# Altium schematic sheet Sheet1.SchDoc
size A4
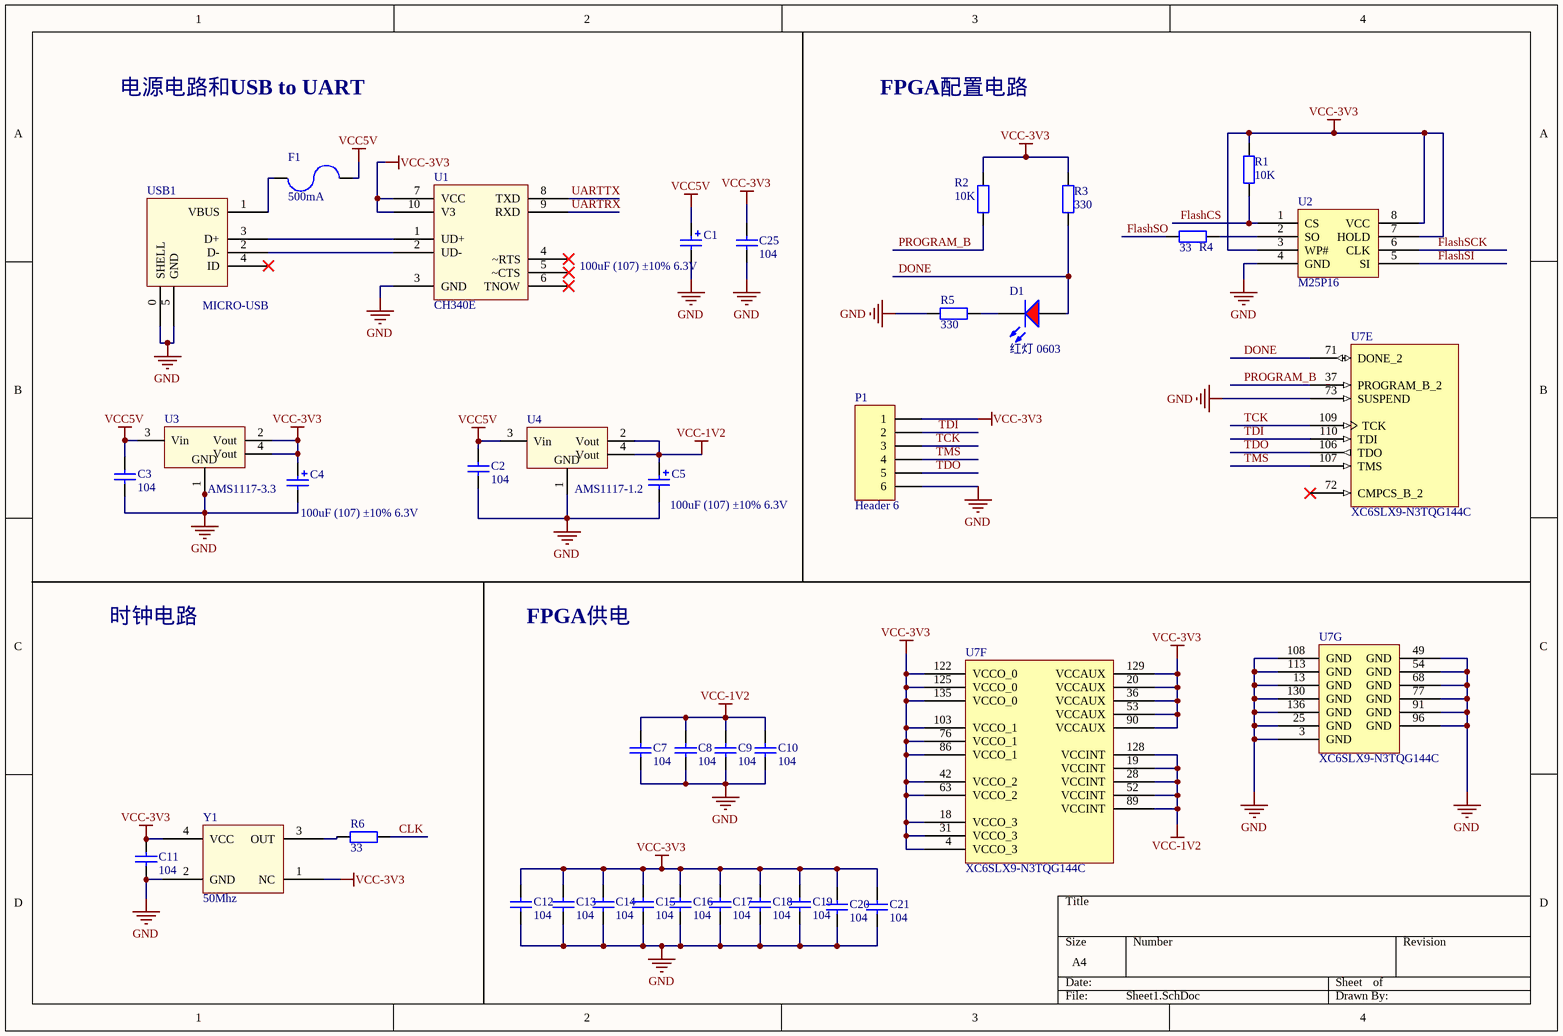
[diagram p0: Sheet1.SchDoc]

## Parts
C1  100uF (107) ±10% 6.3V  [CASE-B_3528]
C2  104  [0603_C]
C3  104  [0603_C]
C4  100uF (107) ±10% 6.3V  [CASE-B_3528]
C5  100uF (107) ±10% 6.3V  [CASE-B_3528]
C7  104  [0603_C]
C8  104  [0603_C]
C9  104  [0603_C]
C10  104  [0603_C]
C11  104  [0603_C]
C12  104  [0603_C]
C13  104  [0603_C]
C14  104  [0603_C]
C15  104  [0603_C]
C16  104  [0603_C]
C17  104  [0603_C]
C18  104  [0603_C]
C19  104  [0603_C]
C20  104  [0603_C]
C21  104  [0603_C]
C25  104  [0603_C]
D1  红灯 0603  [0603_LED_S1]
F1  500mA  [PTC[0805]]
P1  Header 6  [HDR1X6]
R1  10K  [0603_R]
R2  10K  [0603_R]
R3  330  [0603_R]
R4  33  [0603_R]
R5  330  [0603_R]
R6  33  [0603_R]
U1  CH340E  [MSOP10]
U2  M25P16  [SO-8]
U3  AMS1117-3.3  [SOT-223(AMS1117-3.3)]
U4  AMS1117-1.2  [SOT-223(AMS1117-3.3)]
U7  XC6SLX9-N3TQG144C  [TQG144_N]  (parts E,F,G of 7)
USB1  MICRO-USB  [MICRO-USB]
Y1  50Mhz  [XTAL5032]

## Nets
GND: C1.2 C2.1 C3.1 C4.2 C5.2 C7.1 C8.1 C9.1 C10.1 C11.1 C12.1 C13.1 C14.1 C15.1 C16.1 C17.1 C18.1 C19.1 C20.1 C21.1 C25.1 P1.6 R5.2 U1.3(GND) U2.4(GND) U3.1(GND) U4.1(GND) U7.3(GND) U7.13(GND) U7.25(GND) U7.49(GND) U7.54(GND) U7.68(GND) U7.73(SUSPEND) U7.77(GND) U7.91(GND) U7.96(GND) U7.108(GND) U7.113(GND) U7.130(GND) U7.136(GND) USB1.0(SHELL) USB1.5(GND) Y1.2(GND)
VCC5V: C1.1 C2.2 C3.2 F1.1 U3.3(Vin) U4.3(Vin)
VCC-1V2: C5.1 C7.2 C8.2 C9.2 C10.2 U4.2(Vout) U4.4(Vout) U7.19(VCCINT) U7.28(VCCINT) U7.52(VCCINT) U7.89(VCCINT) U7.128(VCCINT)
VCC-3V3: C4.1 C11.2 C12.2 C13.2 C14.2 C15.2 C16.2 C17.2 C18.2 C19.2 C20.2 C21.2 C25.2 P1.1 R1.2 R2.2 R3.2 U1.7(VCC) U1.10(V3) U2.3(WP#) U2.7(HOLD) U2.8(VCC) U3.2(Vout) U3.4(Vout) U7.4(VCCO_3) U7.18(VCCO_3) U7.20(VCCAUX) U7.31(VCCO_3) U7.36(VCCAUX) U7.42(VCCO_2) U7.53(VCCAUX) U7.63(VCCO_2) U7.76(VCCO_1) U7.86(VCCO_1) U7.90(VCCAUX) U7.103(VCCO_1) U7.122(VCCO_0) U7.125(VCCO_0) U7.129(VCCAUX) U7.135(VCCO_0) Y1.1(NC) Y1.4(VCC)
CLK: R6.1
DONE: D1.A R3.1 U7.71(DONE_2)
FlashCS: R1.1 U2.1(CS)
FlashSCK: U2.6(CLK)
FlashSI: U2.5(SI)
FlashSO: R4.2
PROGRAM_B: R2.1 U7.37(PROGRAM_B_2)
TCK: P1.3 U7.109(TCK)
TDI: P1.2 U7.110(TDI)
TDO: P1.5 U7.106(TDO)
TMS: P1.4 U7.107(TMS)
UARTRX: U1.9(RXD)
UARTTX: U1.8(TXD)
NetD1_K: D1.K R5.1
NetF1_2: F1.2 USB1.1(VBUS)
NetR4_1: R4.1 U2.2(SO)
NetR6_2: R6.2 Y1.3(OUT)
NetU1_1: U1.1(UD+) USB1.3(D+)
NetU1_2: U1.2(UD-) USB1.2(D-)

Not connected (* = marked no-connect by the designer): U1 4(~RTS)* 5(~CTS)* 6(TNOW)*; U7 72(CMPCS_B_2)*; USB1 4(ID)*

## Notes on the sheet
- 电源电路和USB to UART
- FPGA配置电路
- 时钟电路
- FPGA供电

## Library data of the parts
C1 C4 C5 = 3528 100uF (107) 10% 6.3V: 钽电容; ComponentLink1Description: 供应商链接; ComponentLink1URL: http://www.szlcsc.com/product/details_16815.html; Package: 3528; Supplier: LC; SuppliersPartNumber: C16133
C2 C3 C7-C21 C25 = 0603 30pF (300) 5% 50V: 贴片电容; ComponentLink1Description: 供应商链接; ComponentLink1URL: http://www.szlcsc.com/product/details_23122.html; Package: 0603; Supplier: LC; SuppliersPartNumber: C22397
D1 = 0603 红灯: 发光二极管; ComponentLink1Description: 供应商链接; ComponentLink1URL: http://www.szlcsc.com/product/details_2659.html; Package: 0603; Supplier: LC; SuppliersPartNumber: C2286
F1 = PTC
P1 = Header 6: Header, 6-Pin; LatestRevisionDate: 17-Jul-2002; LatestRevisionNote: Re-released for DXP Platform.; Publisher: Altium Limited
R1-R6 = 0603 9.1KΩ (9101) 1%: 贴片电阻; ComponentLink1Description: 供应商链接; ComponentLink1URL: http://www.szlcsc.com/product/details_23987.html; Package: 0603; Supplier: LC; SuppliersPartNumber: C23260
U2 = W25Q64
U4 = AMS1117-3.3
U7 = XC6SLX9-N3TQG144C: Spartan-6 LX 1.2V FPGA, 102 User I/Os, 144-Pin TQFP (0.5mm Pitch), Speed Grade 3N, Commercial Grade, Pb-Free; Published: 24-Aug-2010; DatasheetVersion: ver1.6, Nov-2010; PackageVersion: ver1.2, Jun-2004; PackageReference: TQG144; Publisher: Altium Limited; PackageDescription: 144-Pin Thin Quad Flat Pack (TQG144) - Pb-Free; Code_JEDEC: MS-026-BFB; ComponentLink1Description: Manufacturer Link; ComponentLink1URL: http://www.xilinx.com; ComponentLink2Description: Spartan-6 Datasheet; ComponentLink2URL: http://www.xilinx.com/support/documentation/data_sheets/ds160.pdf; ComponentLink3Description: Spartan-6 Documents; ComponentLink3URL: http://www.xilinx.com/support/documentation/spartan-6.htm; ComponentLink4Description: Xilinx.com Home; ComponentLink4URL: http://www.xilinx.com
Y1 = 有源晶振